# Altium project GiroScopeTest.PrjPcb (part 2 of 2)

## Sheet Dual_chanel.SchDoc
size A1; SheetNumber: 2; SheetTotal: 2
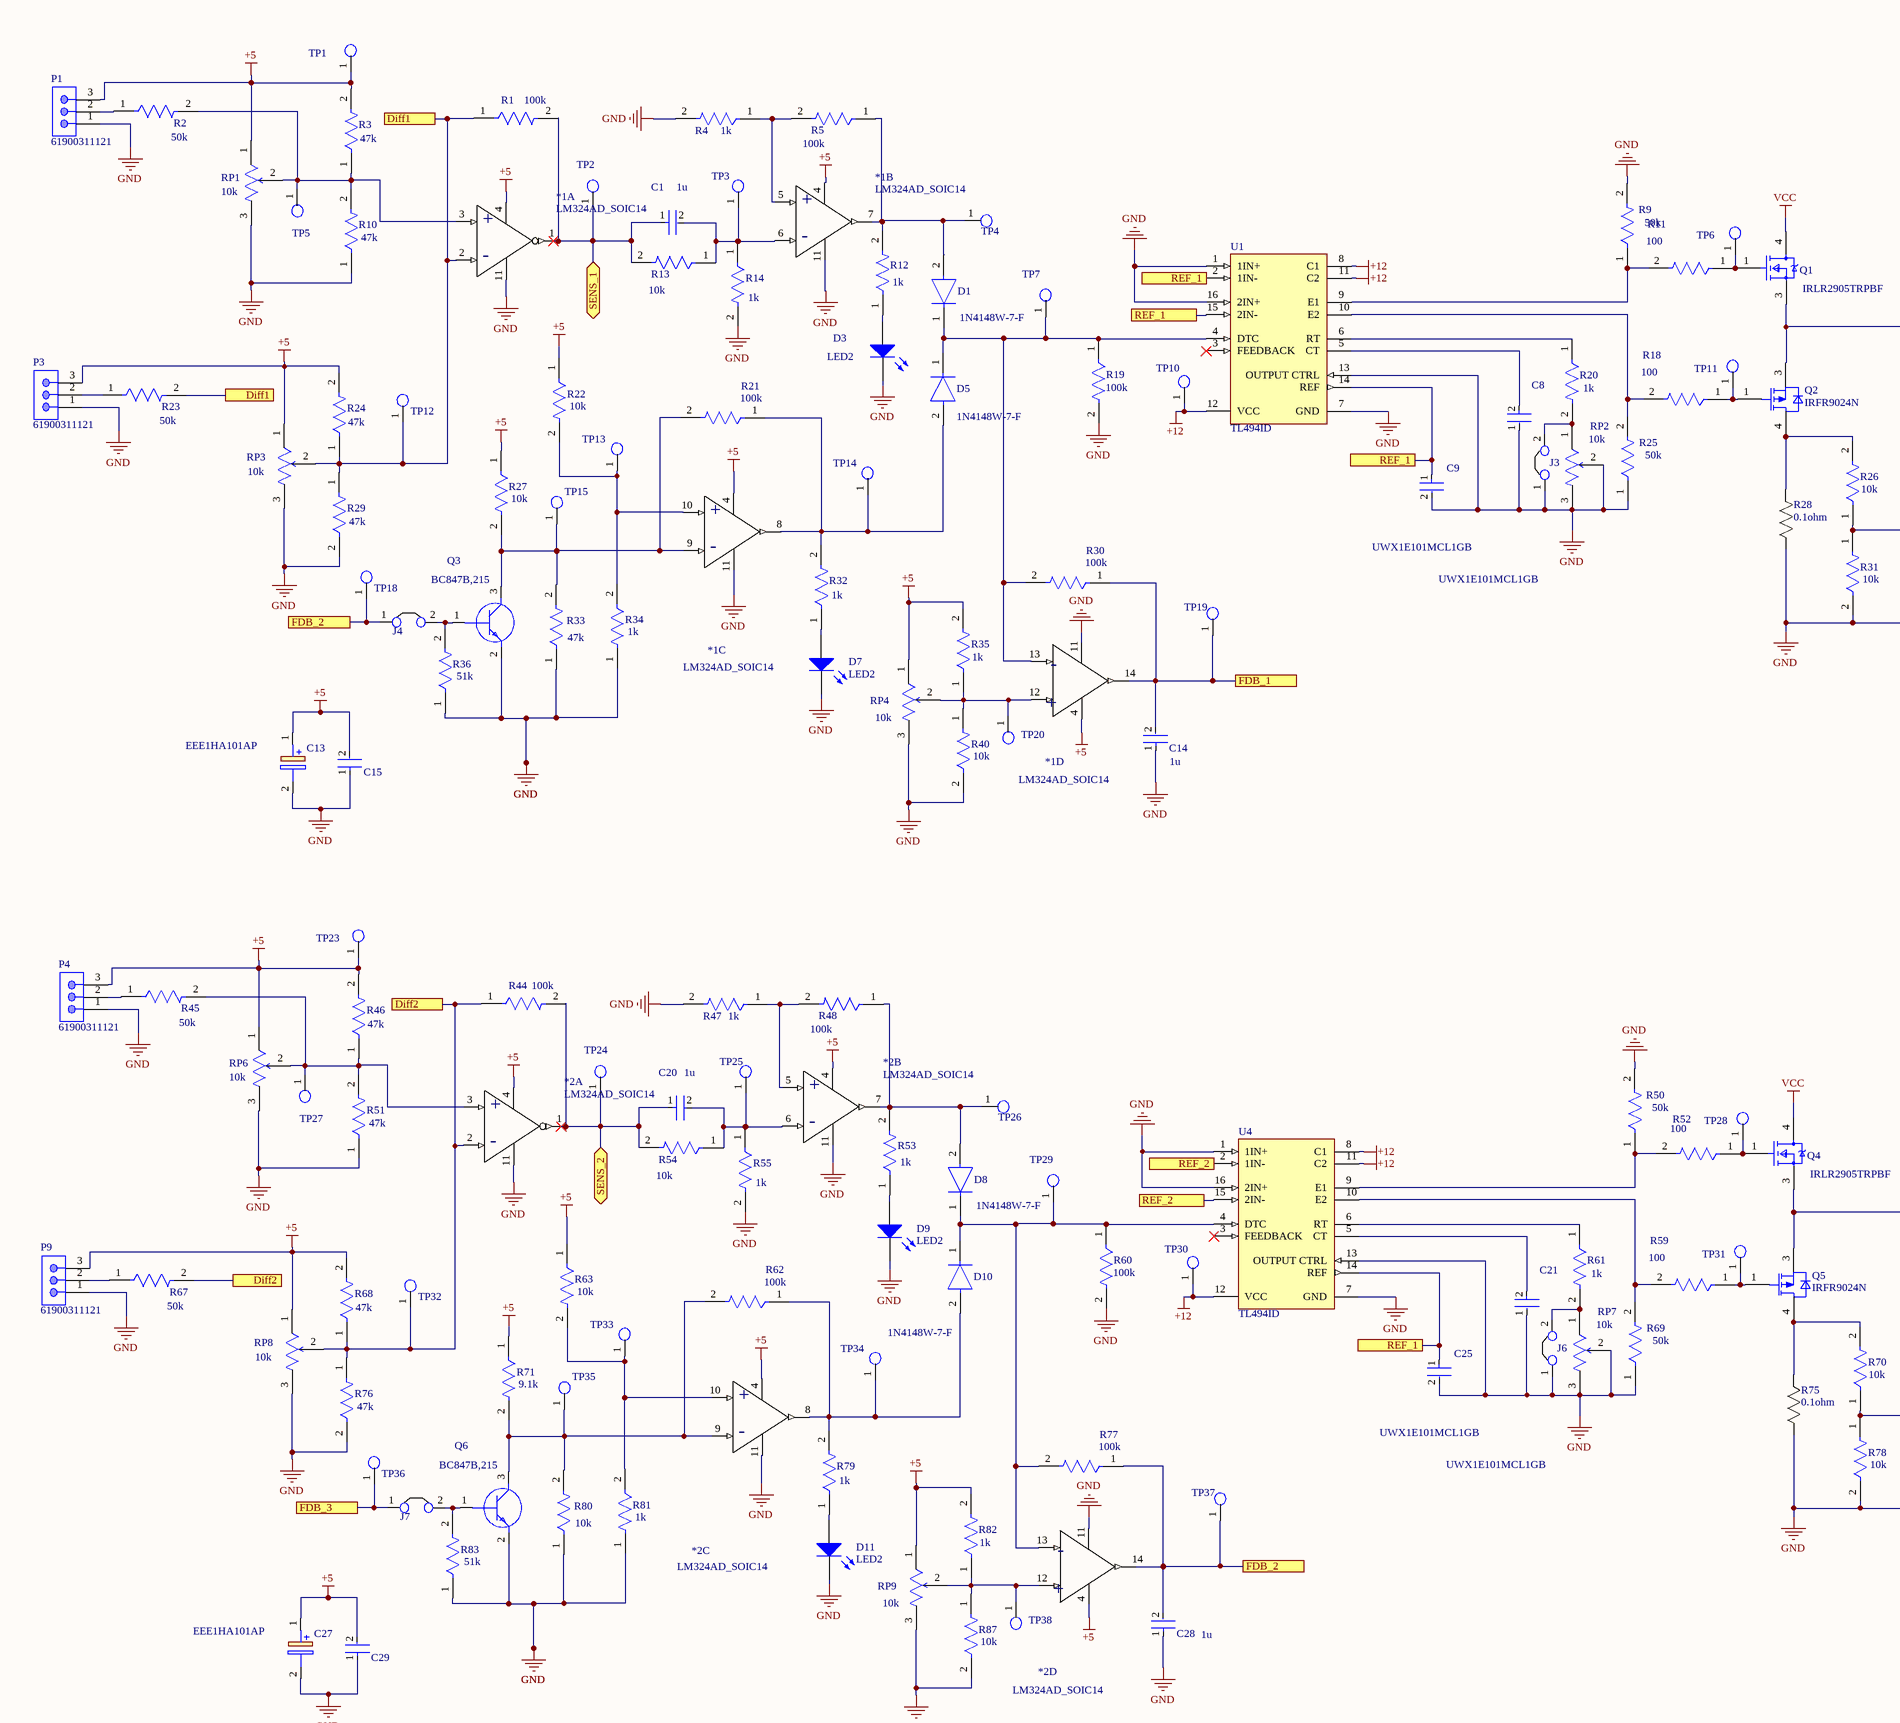
[diagram p4: Dual_chanel.SchDoc, top left]
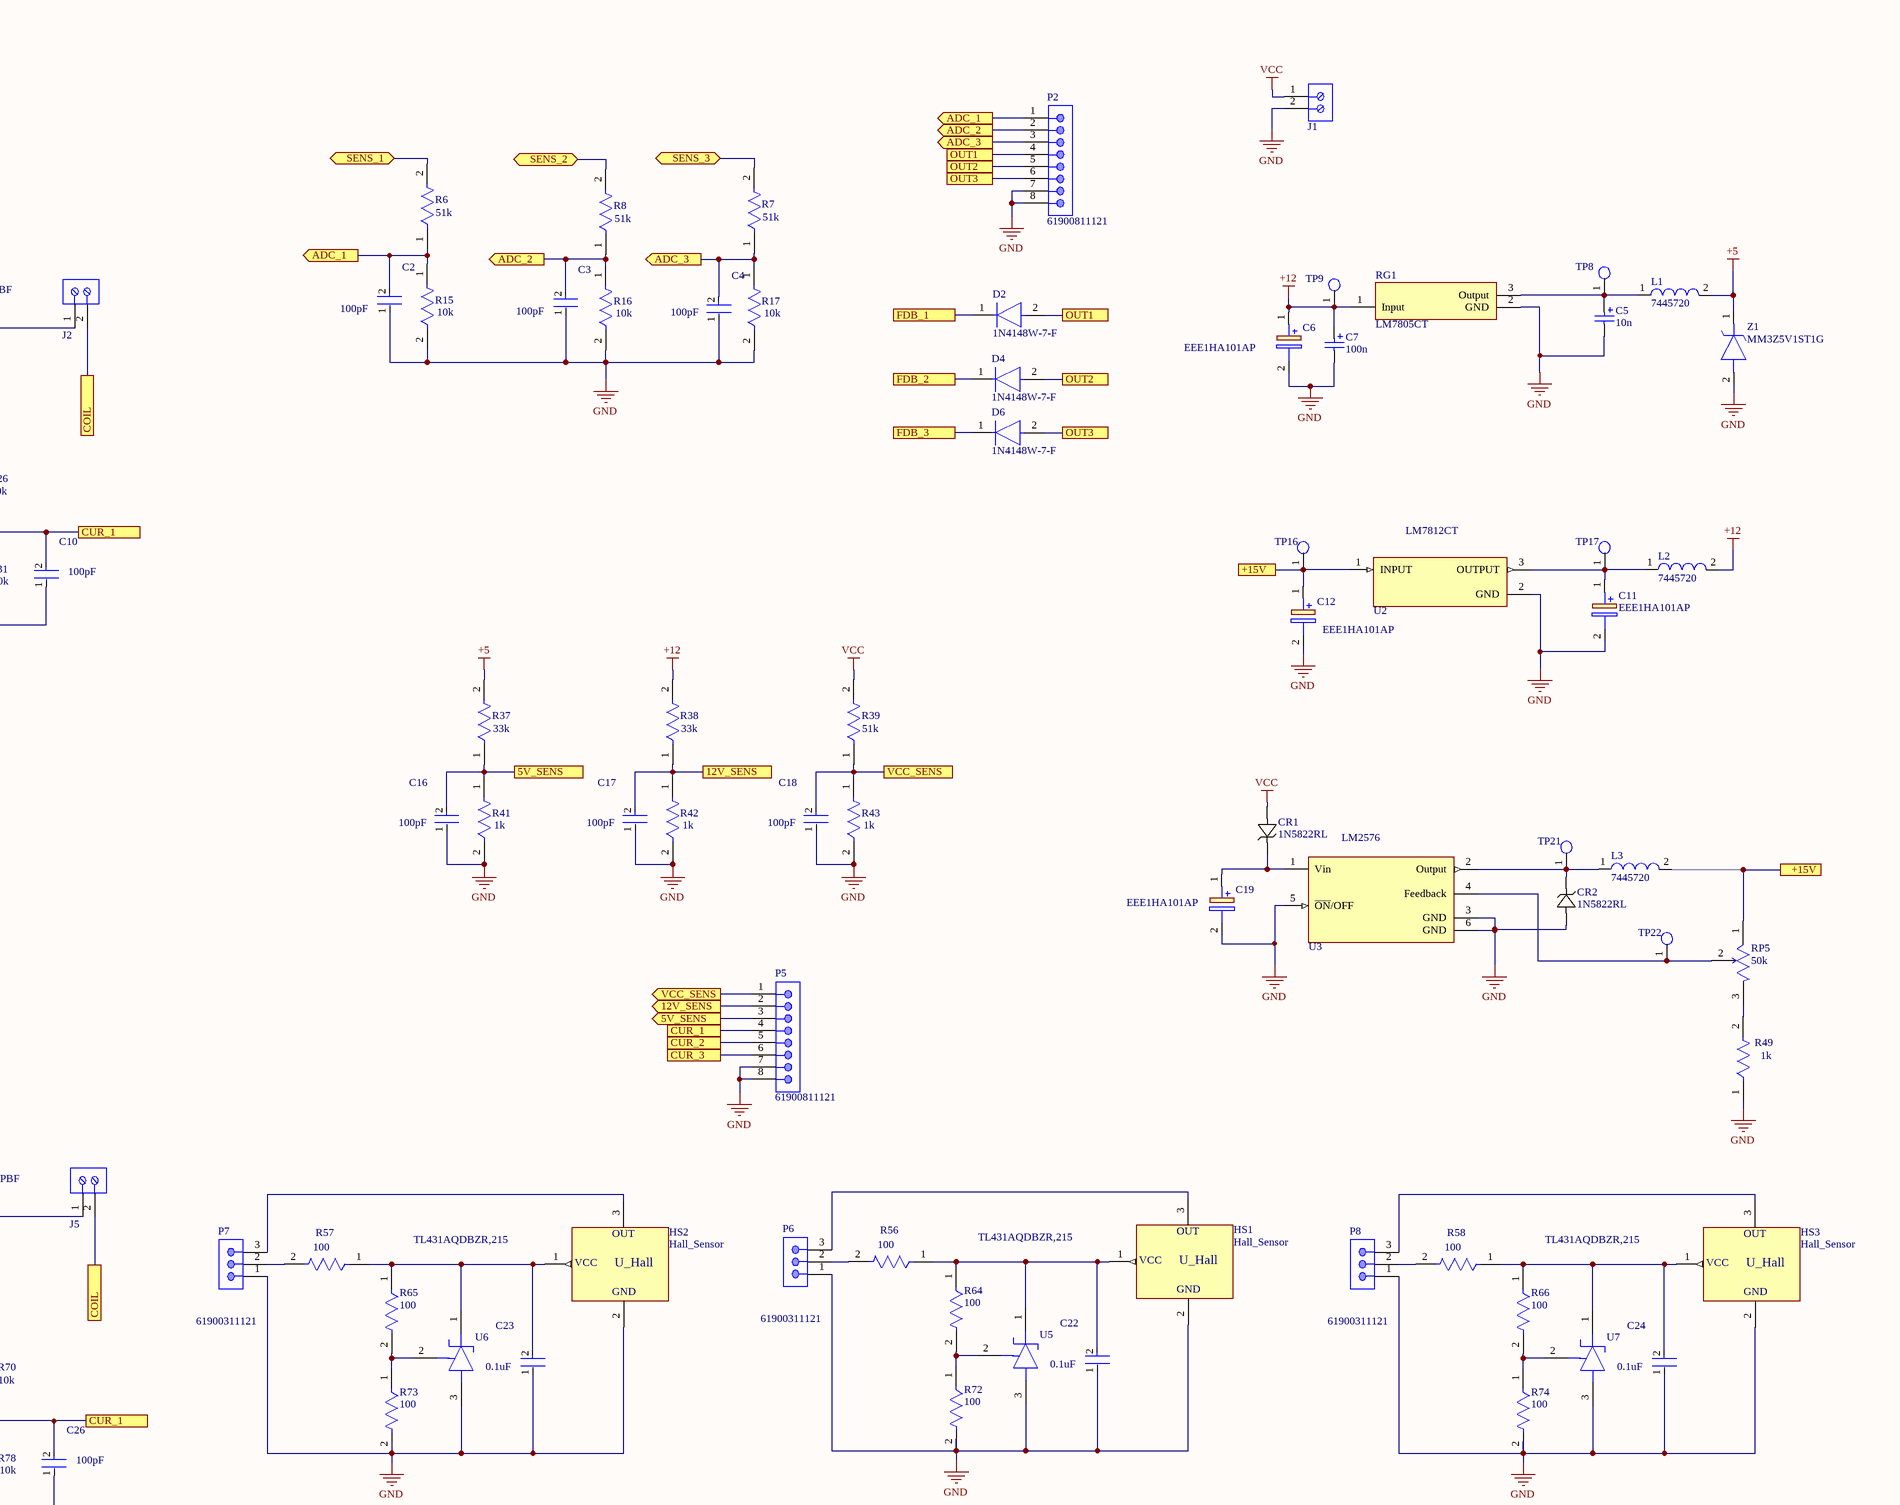
[diagram p5: Dual_chanel.SchDoc, top right]
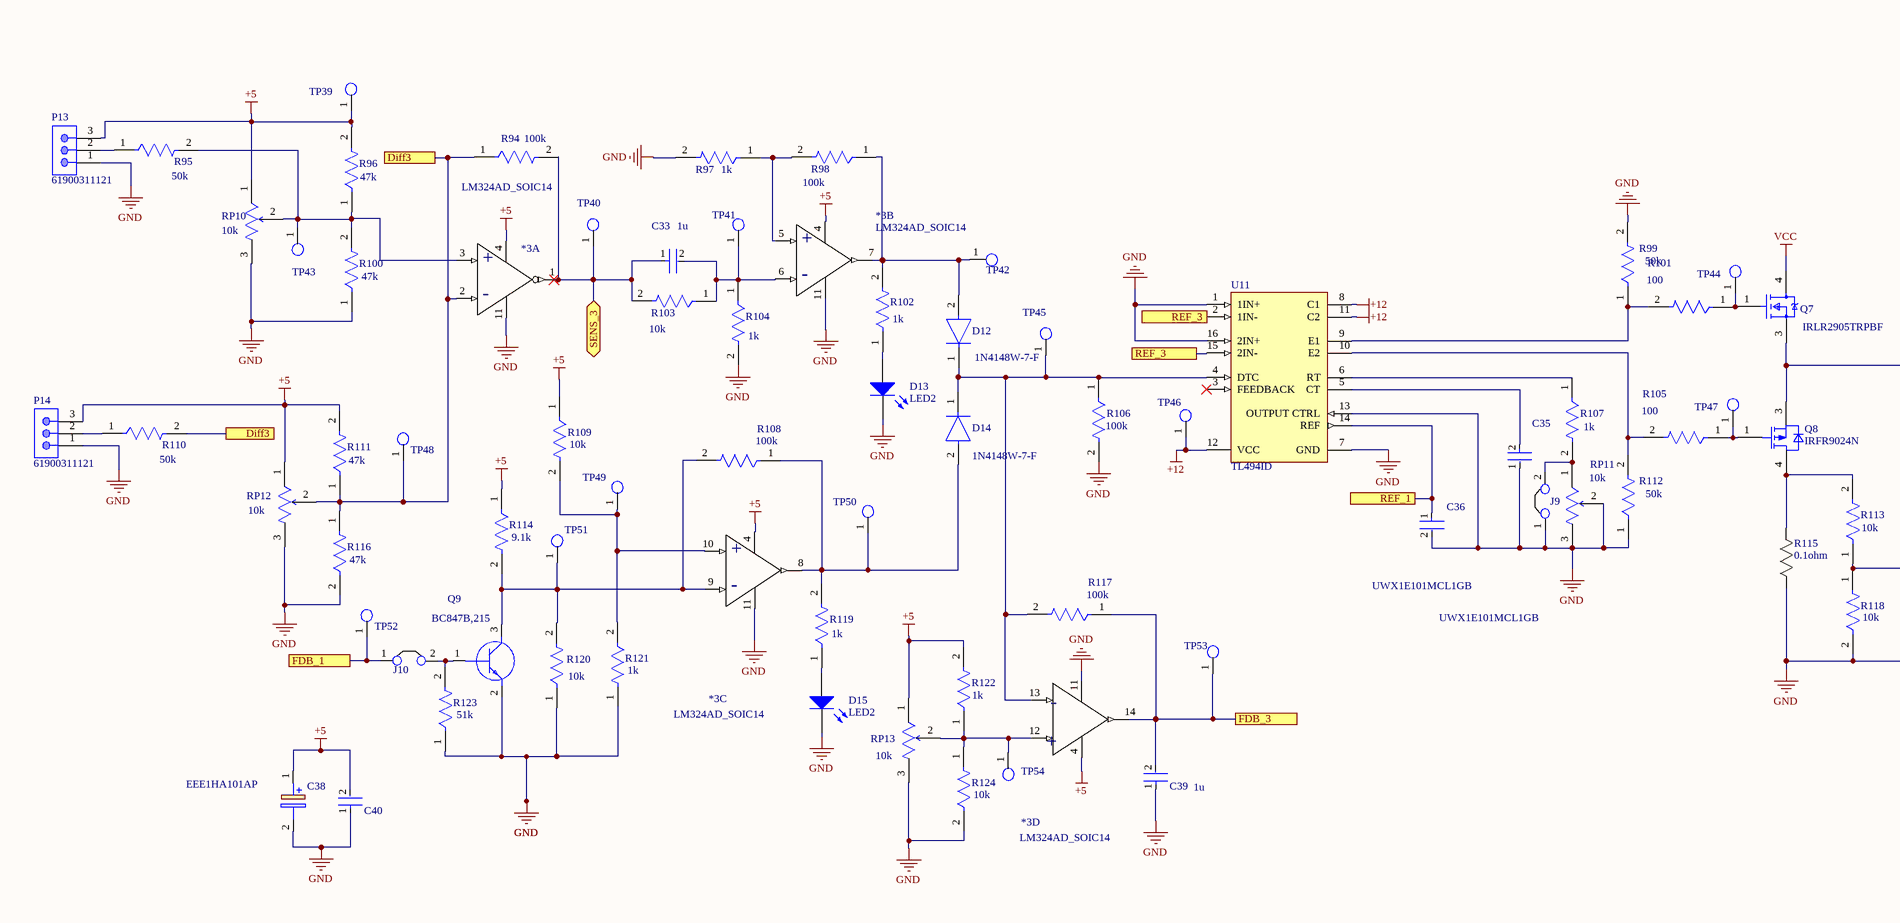
[diagram p6: Dual_chanel.SchDoc, bottom left]
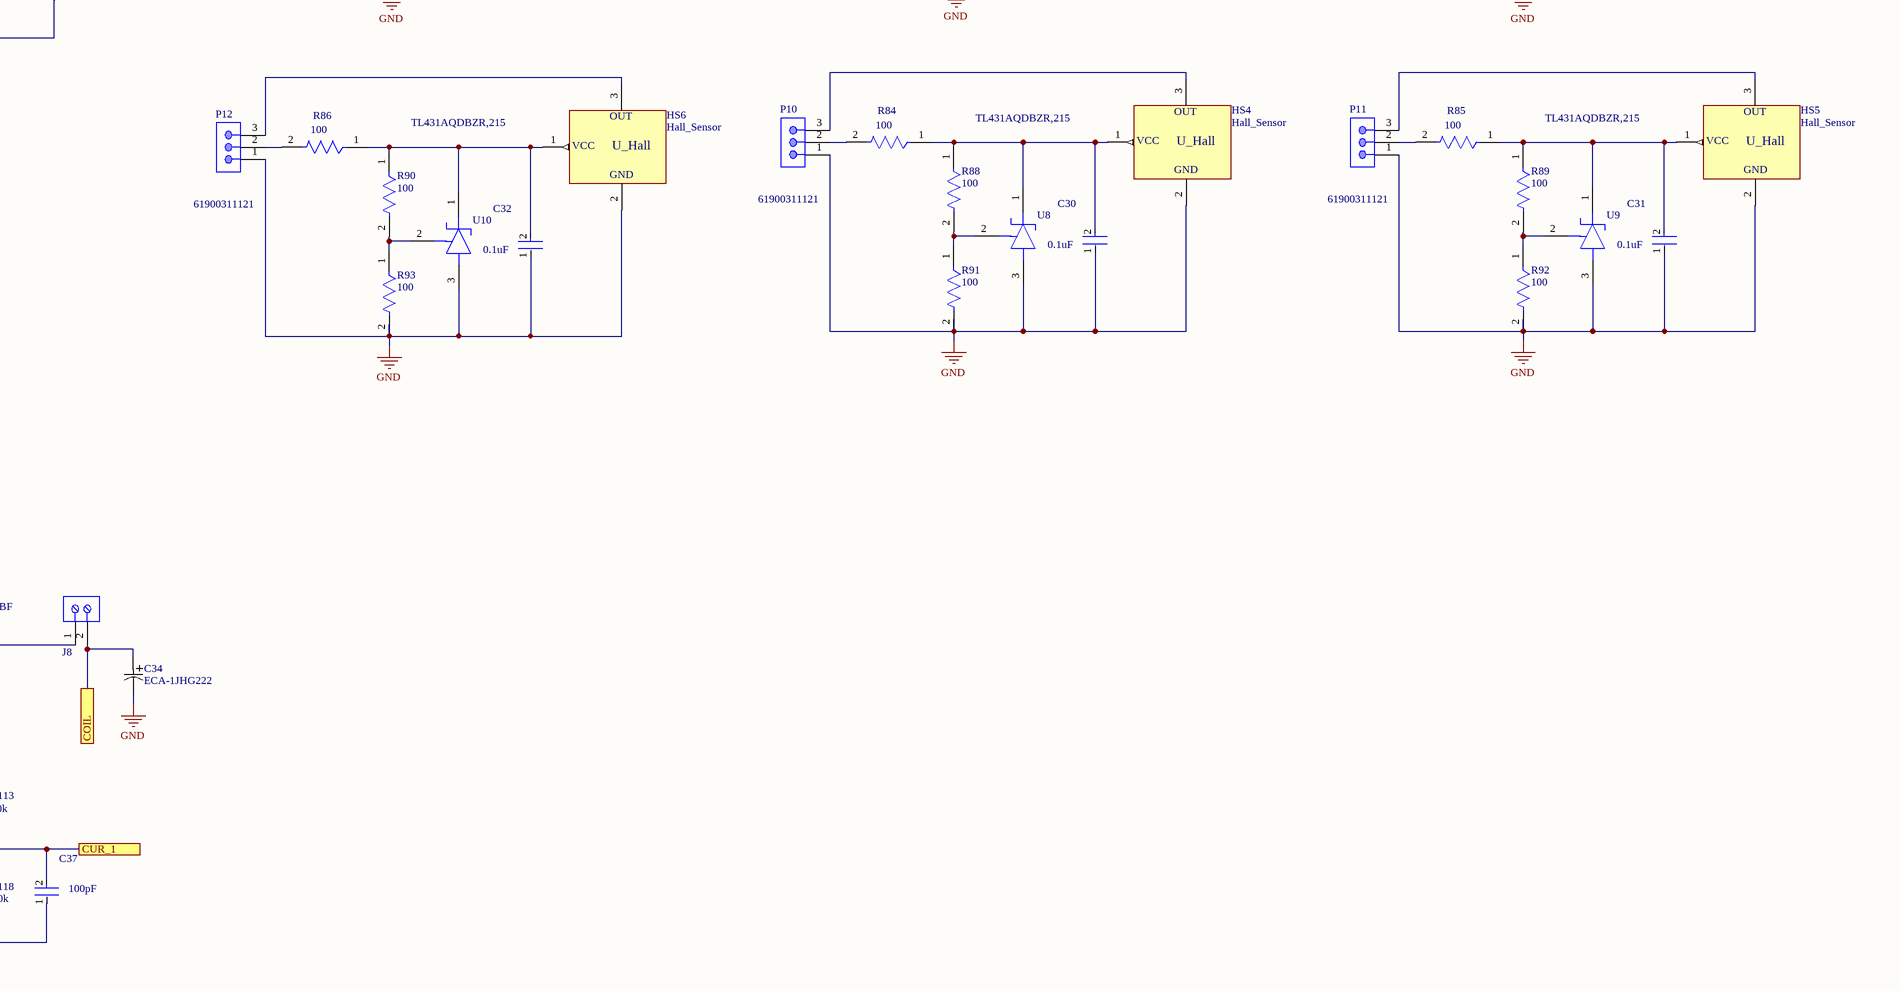
[diagram p7: Dual_chanel.SchDoc, bottom right]

### Parts
(Parts that share a designator on the sheet are numbered #1, #2 ... from top to bottom, then left to right.)
*1#2  LM324AD_SOIC14  [D14-M]  (parts A,B,C,D of 4)
*2#2  LM324AD_SOIC14  [D14-M]  (parts A,B,C,D of 4)
*3  LM324AD_SOIC14  [D14-M]  (parts A,B,C,D of 4)
C1#2  1u  [KEMET_C0805C-DN_IPC_A]
C2#2  100pF  [KEMET_C0805C-DN_IPC_A]
C3#2  100pF  [KEMET_C0805C-DN_IPC_A]
C4#2  100pF  [KEMET_C0805C-DN_IPC_A]
C5#2  10n  [KEMET_C0805C-DN_IPC_A]
C6#2  EEE1HA101AP  [EEEFK1V331P]
C7#2  100n  [KEMET_C0805C-DN_IPC_A]
C8#2  UWX1E101MCL1GB  [KEMET_C0805C-DN_IPC_A]
C9#2  UWX1E101MCL1GB  [KEMET_C0805C-DN_IPC_A]
C10#2  100pF  [KEMET_C0805C-DN_IPC_A]
C11#2  EEE1HA101AP  [EEEFK1V331P]
C12#2  EEE1HA101AP  [EEEFK1V331P]
C13#2  EEE1HA101AP  [EEEFK1V331P]
C14#2  1u  [KEMET_C0805C-DN_IPC_A]
C15#2  1u  [KEMET_C0805C-DN_IPC_A]  (value not drawn)
C16#2  100pF  [KEMET_C0805C-DN_IPC_A]
C17#2  100pF  [KEMET_C0805C-DN_IPC_A]
C18#2  100pF  [KEMET_C0805C-DN_IPC_A]
C19#2  EEE1HA101AP  [EEEFK1V331P]
C20#2  1u  [KEMET_C0805C-DN_IPC_A]
C21#2  UWX1E101MCL1GB  [KEMET_C0805C-DN_IPC_A]
C22#2  0.1uF  [KEMET_C0805C-DN_IPC_C]
C23#2  0.1uF  [KEMET_C0805C-DN_MFG]
C24#2  0.1uF  [KEMET_C0805C-DN_IPC_C]
C25#2  UWX1E101MCL1GB  [KEMET_C0805C-DN_IPC_A]
C26#2  100pF  [KEMET_C0805C-DN_IPC_A]
C27#2  EEE1HA101AP  [EEEFK1V331P]
C28#2  1u  [KEMET_C0805C-DN_IPC_A]
C29#2  1u  [KEMET_C0805C-DN_IPC_A]  (value not drawn)
C30#2  0.1uF  [KEMET_C0805C-DN_IPC_C]
C31#2  0.1uF  [KEMET_C0805C-DN_IPC_C]
C32#2  0.1uF  [KEMET_C0805C-DN_MFG]
C33#2  1u  [KEMET_C0805C-DN_IPC_A]
C34#2  ECA-1JHG222  [CAPPRD500W60D1000H1250]
C35#2  UWX1E101MCL1GB  [KEMET_C0805C-DN_IPC_A]
C36#2  UWX1E101MCL1GB  [KEMET_C0805C-DN_IPC_A]
C37#2  100pF  [KEMET_C0805C-DN_IPC_A]
C38#2  EEE1HA101AP  [EEEFK1V331P]
C39#2  1u  [KEMET_C0805C-DN_IPC_A]
C40  1u  [KEMET_C0805C-DN_IPC_A]  (value not drawn)
CR1#2  1N5822RL  [DO-201AD_STM]
CR2#2  1N5822RL  [DO-201AD_STM]
D1#2  1N4148W-7-F  [ONSC-SOD-123-2-425-04_V]
D2#2  1N4148W-7-F  [Vishay_S8-V-3910_01-001_IPC_A]
D3#2  LED2  [Wurth_Electronics_0_MFG]
D4#2  1N4148W-7-F  [Vishay_S8-V-3910_01-001_IPC_A]
D5#2  1N4148W-7-F  [ONSC-SOD-123-2-425-04_V]
D6#2  1N4148W-7-F  [Vishay_S8-V-3910_01-001_IPC_A]
D7#2  LED2  [Wurth_Electronics_0_MFG]
D8#2  1N4148W-7-F  [Vishay_S8-V-3910_01-001_IPC_A]
D9#2  LED2  [Wurth_Electronics_0_MFG]
D10#2  1N4148W-7-F  [Vishay_S8-V-3910_01-001_IPC_A]
D11#2  LED2  [Wurth_Electronics_0_MFG]
D12#2  1N4148W-7-F  [Vishay_S8-V-3910_01-001_IPC_A]
D13#2  LED2  [Wurth_Electronics_0_MFG]
D14#2  1N4148W-7-F  [Vishay_S8-V-3910_01-001_IPC_A]
D15#2  LED2  [Wurth_Electronics_0_MFG]
HS1#2  Hall_Sensor  [TO-92A]
HS2#2  Hall_Sensor  [TO-92A]
HS3#2  Hall_Sensor  [TO-92A]
HS4#2  Hall_Sensor  [TO-92A]
HS5#2  Hall_Sensor  [TO-92A]
HS6#2  Hall_Sensor  [TO-92A]
J1#2  691103110003  [691101710002]  (value not drawn)
J2#2  691101710002  [691101710002]  (value not drawn)
J3#2  Jumper 1x2.54  [Jumper_2.54]  (value not drawn)
J4#2  Jumper 1x2.54  [Jumper_2.54]  (value not drawn)
J5#2  691101710002  [691101710002]  (value not drawn)
J6#2  Jumper 1x2.54  [Jumper_2.54]  (value not drawn)
J7#2  Jumper 1x2.54  [Jumper_2.54]  (value not drawn)
J8#2  691101710002  [691101710002]  (value not drawn)
J9#2  Jumper 1x2.54  [Jumper_2.54]  (value not drawn)
J10#2  Jumper 1x2.54  [Jumper_2.54]  (value not drawn)
L1#2  7445720  [WE-PD2-L]
L2#2  7445720  [WE-PD2-L]
L3#2  7445720  [WE-PD2-L]
P1#2  61900311121  [61900311121]
P2#2  61900811121  [61900811121]
P3#2  61900311121  [61900311121]
P4#2  61900311121  [61900311121]
P5#2  61900811121  [61900811121]
P6#2  61900311121  [61900311121]
P7#2  61900311121  [61900311121]
P8#2  61900311121  [61900311121]
P9#2  61900311121  [61900311121]
P10#2  61900311121  [61900311121]
P11#2  61900311121  [61900311121]
P12#2  61900311121  [61900311121]
P13#2  61900311121  [61900311121]
P14#2  61900311121  [61900311121]
Q1#2  IRLR2905TRPBF  [TO229P991X239-3_4N]
Q2#2  IRFR9024N  [TO229P991X239-3_4N]
Q3#2  BC847B,215  [BC847B215]
Q4#2  IRLR2905TRPBF  [Infineon_Technologies_PG-TO252-3_MFG]
Q5#2  IRFR9024N  [TO229P991X239-3_4N]
Q6#2  BC847B,215  [BC847B215]
Q7  IRLR2905TRPBF  [Infineon_Technologies_PG-TO252-3_MFG]
Q8  IRFR9024N  [TO229P991X239-3_4N]
Q9  BC847B,215  [BC847B215]
R1#2  100k  [Vishay_CRCW0805-e3_IPC_A]
R2#2  50k  [Vishay_CRCW0805-e3_IPC_A]
R3#2  47k  [Vishay_CRCW0805-e3_IPC_A]
R4#2  1k  [Vishay_CRCW0805-e3_IPC_A]
R5#2  100k  [Vishay_CRCW0805-e3_IPC_A]
R6#2  51k  [Vishay_CRCW0805-e3_IPC_A]
R7#2  51k  [Vishay_CRCW0805-e3_IPC_A]
R8#2  51k  [Vishay_CRCW0805-e3_IPC_A]
R9#2  50k  [Vishay_CRCW0805-e3_IPC_A]
R10#2  47k  [Vishay_CRCW0805-e3_IPC_A]
R11#2  100  [Vishay_CRCW0805-e3_IPC_A]
R12#2  1k  [Vishay_CRCW0805-e3_IPC_A]
R13#2  10k  [Vishay_CRCW0805-e3_IPC_A]
R14#2  1k  [Vishay_CRCW0805-e3_IPC_A]
R15#2  10k  [Vishay_CRCW0805-e3_IPC_A]
R16#2  10k  [Vishay_CRCW0805-e3_IPC_A]
R17#2  10k  [Vishay_CRCW0805-e3_IPC_A]
R18#2  100  [Vishay_CRCW0805-e3_IPC_A]
R19#2  100k  [Vishay_CRCW0805-e3_IPC_A]
R20#2  1k  [Vishay_CRCW0805-e3_IPC_A]
R21#2  100k  [Vishay_CRCW0805-e3_IPC_A]
R22#2  10k  [Vishay_CRCW0805-e3_IPC_A]
R23#2  50k  [Vishay_CRCW0805-e3_IPC_A]
R24#2  47k  [Vishay_CRCW0805-e3_IPC_A]
R25#2  50k  [Vishay_CRCW0805-e3_IPC_A]
R26#2  10k  [Vishay_CRCW0805-e3_IPC_A]
R27#2  10k  [Vishay_CRCW0805-e3_IPC_A]
R28#2  0.1ohm  [RES_TUM5_OHM]
R29#2  47k  [Vishay_CRCW0805-e3_IPC_A]
R30#2  100k  [Vishay_CRCW0805-e3_IPC_A]
R31#2  10k  [Vishay_CRCW0805-e3_IPC_A]
R32  1k  [Vishay_CRCW0805-e3_IPC_A]
R33#2  47k  [Vishay_CRCW0805-e3_IPC_A]
R34#2  1k  [Vishay_CRCW0805-e3_IPC_A]
R35#2  1k  [Vishay_CRCW0805-e3_IPC_A]
R36#2  51k  [Vishay_CRCW0805-e3_IPC_A]
R37#2  33k  [Vishay_CRCW0805-e3_IPC_A]
R38#2  33k  [Vishay_CRCW0805-e3_IPC_A]
R39#2  51k  [Vishay_CRCW0805-e3_IPC_A]
R40  10k  [Vishay_CRCW0805-e3_IPC_A]
R41#2  1k  [Vishay_CRCW0805-e3_IPC_A]
R42#2  1k  [Vishay_CRCW0805-e3_IPC_A]
R43#2  1k  [Vishay_CRCW0805-e3_IPC_A]
R44  100k  [Vishay_CRCW0805-e3_IPC_A]
R45#2  50k  [Vishay_CRCW0805-e3_IPC_A]
R46#2  47k  [Vishay_CRCW0805-e3_IPC_A]
R47#2  1k  [Vishay_CRCW0805-e3_IPC_A]
R48#2  100k  [Vishay_CRCW0805-e3_IPC_A]
R49#2  1k  [Vishay_CRCW0805-e3_IPC_A]
R50#2  50k  [Vishay_CRCW0805-e3_IPC_A]
R51#2  47k  [Vishay_CRCW0805-e3_IPC_A]
R52#2  100  [Vishay_CRCW0805-e3_IPC_A]
R53#2  1k  [Vishay_CRCW0805-e3_IPC_A]
R54#2  10k  [Vishay_CRCW0805-e3_IPC_A]
R55#2  1k  [Vishay_CRCW0805-e3_IPC_A]
R56#2  100  [Vishay_CRCW0805-e3_IPC_B]
R57#2  100  [Vishay_CRCW0805-e3_IPC_B]
R58#2  100  [Vishay_CRCW0805-e3_IPC_B]
R59  100  [Vishay_CRCW0805-e3_IPC_A]
R60#2  100k  [Vishay_CRCW0805-e3_IPC_A]
R61#2  1k  [Vishay_CRCW0805-e3_IPC_A]
R62#2  100k  [Vishay_CRCW0805-e3_IPC_A]
R63#2  10k  [Vishay_CRCW0805-e3_IPC_A]
R64#2  100  [Vishay_CRCW0805-e3_IPC_B]
R65#2  100  [Vishay_CRCW0805-e3_IPC_B]
R66  100  [Vishay_CRCW0805-e3_IPC_B]
R67#2  50k  [Vishay_CRCW0805-e3_IPC_A]
R68#2  47k  [Vishay_CRCW0805-e3_IPC_A]
R69#2  50k  [Vishay_CRCW0805-e3_IPC_A]
R70  10k  [Vishay_CRCW0805-e3_IPC_A]
R71#2  9.1k  [Vishay_CRCW0805-e3_IPC_A]
R72#2  100  [Vishay_CRCW0805-e3_IPC_B]
R73#2  100  [Vishay_CRCW0805-e3_IPC_B]
R74#2  100  [Vishay_CRCW0805-e3_IPC_B]
R75#2  0.1ohm  [RES_TUM5_OHM]
R76#2  47k  [Vishay_CRCW0805-e3_IPC_A]
R77#2  100k  [Vishay_CRCW0805-e3_IPC_A]
R78#2  10k  [Vishay_CRCW0805-e3_IPC_A]
R79#2  1k  [Vishay_CRCW0805-e3_IPC_A]
R80#2  10k  [Vishay_CRCW0805-e3_IPC_A]
R81#2  1k  [Vishay_CRCW0805-e3_IPC_A]
R82#2  1k  [Vishay_CRCW0805-e3_IPC_A]
R83#2  51k  [Vishay_CRCW0805-e3_IPC_A]
R84#2  100  [Vishay_CRCW0805-e3_IPC_B]
R85#2  100  [Vishay_CRCW0805-e3_IPC_B]
R86#2  100  [Vishay_CRCW0805-e3_IPC_B]
R87#2  10k  [Vishay_CRCW0805-e3_IPC_A]
R88#2  100  [Vishay_CRCW0805-e3_IPC_B]
R89#2  100  [Vishay_CRCW0805-e3_IPC_B]
R90#2  100  [Vishay_CRCW0805-e3_IPC_B]
R91#2  100  [Vishay_CRCW0805-e3_IPC_B]
R92#2  100  [Vishay_CRCW0805-e3_IPC_B]
R93#2  100  [Vishay_CRCW0805-e3_IPC_B]
R94#2  100k  [Vishay_CRCW0805-e3_IPC_A]
R95#2  50k  [Vishay_CRCW0805-e3_IPC_A]
R96#2  47k  [Vishay_CRCW0805-e3_IPC_A]
R97#2  1k  [Vishay_CRCW0805-e3_IPC_A]
R98#2  100k  [Vishay_CRCW0805-e3_IPC_A]
R99#2  50k  [Vishay_CRCW0805-e3_IPC_A]
R100#2  47k  [Vishay_CRCW0805-e3_IPC_A]
R101#2  100  [Vishay_CRCW0805-e3_IPC_A]
R102#2  1k  [Vishay_CRCW0805-e3_IPC_A]
R103#2  10k  [Vishay_CRCW0805-e3_IPC_A]
R104#2  1k  [Vishay_CRCW0805-e3_IPC_A]
R105#2  100  [Vishay_CRCW0805-e3_IPC_A]
R106#2  100k  [Vishay_CRCW0805-e3_IPC_A]
R107#2  1k  [Vishay_CRCW0805-e3_IPC_A]
R108#2  100k  [Vishay_CRCW0805-e3_IPC_A]
R109#2  10k  [Vishay_CRCW0805-e3_IPC_A]
R110#2  50k  [Vishay_CRCW0805-e3_IPC_A]
R111#2  47k  [Vishay_CRCW0805-e3_IPC_A]
R112#2  50k  [Vishay_CRCW0805-e3_IPC_A]
R113#2  10k  [Vishay_CRCW0805-e3_IPC_A]
R114#2  9.1k  [Vishay_CRCW0805-e3_IPC_A]
R115#2  0.1ohm  [RES_TUM5_OHM]
R116#2  47k  [Vishay_CRCW0805-e3_IPC_A]
R117#2  100k  [Vishay_CRCW0805-e3_IPC_A]
R118#2  10k  [Vishay_CRCW0805-e3_IPC_A]
R119#2  1k  [Vishay_CRCW0805-e3_IPC_A]
R120#2  10k  [Vishay_CRCW0805-e3_IPC_A]
R121#2  1k  [Vishay_CRCW0805-e3_IPC_A]
R122#2  1k  [Vishay_CRCW0805-e3_IPC_A]
R123#2  51k  [Vishay_CRCW0805-e3_IPC_A]
R124#2  10k  [Vishay_CRCW0805-e3_IPC_A]
RG1#2  Part Number: LM7805CT  [Fairchild_LM7805CT_0]  (hidden comment: Reg_Fairchild_LM7805CT_eec)
RP1#2  10k  [Bourns_3296W_MFG]
RP2#2  10k  [Bourns_3296W_MFG]
RP3#2  10k  [Bourns_3296W_MFG]
RP4#2  10k  [Bourns_3296W_MFG]
RP5#2  50k  [Bourns_3296W_MFG]
RP6#2  10k  [Bourns_3296W_MFG]
RP7#2  10k  [Bourns_3296W_MFG]
RP8#2  10k  [Bourns_3296W_MFG]
RP9#2  10k  [Bourns_3296W_MFG]
RP10#2  10k  [Bourns_3296W_MFG]
RP11#2  10k  [Bourns_3296W_MFG]
RP12#2  10k  [Bourns_3296W_MFG]
RP13#2  10k  [Bourns_3296W_MFG]
TP1#2  Test_Point_PCB  [Test_Point]  (value not drawn)
TP2#2  Test_Point_PCB  [Test_Point]  (value not drawn)
TP3#2  Test_Point_PCB  [Test_Point]  (value not drawn)
TP4#2  Test_Point_PCB  [Test_Point]  (value not drawn)
TP5#2  Test_Point_PCB  [Test_Point]  (value not drawn)
TP6#2  Test_Point_PCB  [Test_Point]  (value not drawn)
TP7#2  Test_Point_PCB  [Test_Point]  (value not drawn)
TP8#2  Test_Point_PCB  [Test_Point]  (value not drawn)
TP9#2  Test_Point_PCB  [Test_Point]  (value not drawn)
TP10#2  Test_Point_PCB  [Test_Point]  (value not drawn)
TP11#2  Test_Point_PCB  [Test_Point]  (value not drawn)
TP12#2  Test_Point_PCB  [Test_Point]  (value not drawn)
TP13#2  Test_Point_PCB  [Test_Point]  (value not drawn)
TP14#2  Test_Point_PCB  [Test_Point]  (value not drawn)
TP15#2  Test_Point_PCB  [Test_Point]  (value not drawn)
TP16#2  Test_Point_PCB  [Test_Point]  (value not drawn)
TP17#2  Test_Point_PCB  [Test_Point]  (value not drawn)
TP18#2  Test_Point_PCB  [Test_Point]  (value not drawn)
TP19#2  Test_Point_PCB  [Test_Point]  (value not drawn)
TP20#2  Test_Point_PCB  [Test_Point]  (value not drawn)
TP21#2  Test_Point_PCB  [Test_Point]  (value not drawn)
TP22#2  Test_Point_PCB  [Test_Point]  (value not drawn)
TP23#2  Test_Point_PCB  [Test_Point]  (value not drawn)
TP24#2  Test_Point_PCB  [Test_Point]  (value not drawn)
TP25#2  Test_Point_PCB  [Test_Point]  (value not drawn)
TP26#2  Test_Point_PCB  [Test_Point]  (value not drawn)
TP27#2  Test_Point_PCB  [Test_Point]  (value not drawn)
TP28#2  Test_Point_PCB  [Test_Point]  (value not drawn)
TP29#2  Test_Point_PCB  [Test_Point]  (value not drawn)
TP30#2  Test_Point_PCB  [Test_Point]  (value not drawn)
TP31#2  Test_Point_PCB  [Test_Point]  (value not drawn)
TP32#2  Test_Point_PCB  [Test_Point]  (value not drawn)
TP33#2  Test_Point_PCB  [Test_Point]  (value not drawn)
TP34#2  Test_Point_PCB  [Test_Point]  (value not drawn)
TP35#2  Test_Point_PCB  [Test_Point]  (value not drawn)
TP36#2  Test_Point_PCB  [Test_Point]  (value not drawn)
TP37#2  Test_Point_PCB  [Test_Point]  (value not drawn)
TP38#2  Test_Point_PCB  [Test_Point]  (value not drawn)
TP39#2  Test_Point_PCB  [Test_Point]  (value not drawn)
TP40#2  Test_Point_PCB  [Test_Point]  (value not drawn)
TP41#2  Test_Point_PCB  [Test_Point]  (value not drawn)
TP42#2  Test_Point_PCB  [Test_Point]  (value not drawn)
TP43#2  Test_Point_PCB  [Test_Point]  (value not drawn)
TP44#2  Test_Point_PCB  [Test_Point]  (value not drawn)
TP45#2  Test_Point_PCB  [Test_Point]  (value not drawn)
TP46#2  Test_Point_PCB  [Test_Point]  (value not drawn)
TP47#2  Test_Point_PCB  [Test_Point]  (value not drawn)
TP48#2  Test_Point_PCB  [Test_Point]  (value not drawn)
TP49#2  Test_Point_PCB  [Test_Point]  (value not drawn)
TP50#2  Test_Point_PCB  [Test_Point]  (value not drawn)
TP51#2  Test_Point_PCB  [Test_Point]  (value not drawn)
TP52  Test_Point_PCB  [Test_Point]  (value not drawn)
TP53  Test_Point_PCB  [Test_Point]  (value not drawn)
TP54  Test_Point_PCB  [Test_Point]  (value not drawn)
U1#2  TL494ID  [D16-M]
U2#2  LM7812CT  [Fairchild_LM7805CT_0]
U3#2  LM2576  [ON_Semiconductor_936A-02_MFG]
U4#2  TL494ID  [D16-M]
U5#2  Part Number: TL431AQDBZR,215  [Nexperia_TL431AQDBZR,215_0]  (hidden comment: IC_Nexperia_TL431AQDBZR,215_eec)
U6#2  Part Number: TL431AQDBZR,215  [Nexperia_TL431AQDBZR,215_0]  (hidden comment: IC_Nexperia_TL431AQDBZR,215_eec)
U7#2  Part Number: TL431AQDBZR,215  [Nexperia_TL431AQDBZR,215_0]  (hidden comment: IC_Nexperia_TL431AQDBZR,215_eec)
U8#2  Part Number: TL431AQDBZR,215  [Nexperia_TL431AQDBZR,215_0]  (hidden comment: IC_Nexperia_TL431AQDBZR,215_eec)
U9#2  Part Number: TL431AQDBZR,215  [Nexperia_TL431AQDBZR,215_0]  (hidden comment: IC_Nexperia_TL431AQDBZR,215_eec)
U10#2  Part Number: TL431AQDBZR,215  [Nexperia_TL431AQDBZR,215_0]  (hidden comment: IC_Nexperia_TL431AQDBZR,215_eec)
U11#2  TL494ID  [D16-M]
Z1#2  MM3Z5V1ST1G  [SOD2512X110N]

### Ports
5V_SENS, 5V_SENS (out), 12V_SENS, 12V_SENS (out), +15V, ADC_1 (out), ADC_2 (out), ADC_3 (out), COIL, CUR_1, CUR_2, CUR_3, Diff1, Diff2, Diff3, FDB_1, FDB_2, FDB_3, OUT1, OUT2, OUT3, REF_1, REF_2, REF_3, SENS_1 (bidir), SENS_2 (bidir), SENS_3 (bidir), VCC_SENS, VCC_SENS (out)

### Nets
+5: *1#2.4(+VCC) *2#2.4(+VCC) *3.4(+VCC) C13#2.1(+) C15#2.2 C27#2.1(+) C29#2.2 C38#2.1(+) C40.2 L1#2.2 P1#2.3 P3#2.3 P4#2.3 P9#2.3 P13#2.3 P14#2.3 R3#2.2 R22#2.1 R24#2.2 R27#2.1 R35#2.2 R37#2.2 R46#2.2 R63#2.1 R68#2.2 R71#2.1 R82#2.2 R96#2.2 R109#2.1 R111#2.2 R114#2.1 R122#2.2 RP1#2.1(CCW) RP3#2.1(CCW) RP4#2.1(CCW) RP6#2.1(CCW) RP8#2.1(CCW) RP9#2.1(CCW) RP10#2.1(CCW) RP12#2.1(CCW) RP13#2.1(CCW) TP1#2.1(G9) TP23#2.1(G9) TP39#2.1(G9) Z1#2.1(K)
+12: C6#2.1(+) C7#2.1 L2#2.2 R38#2.2 RG1#2.1(Input) TP9#2.1(G9) TP10#2.1(G9) TP30#2.1(G9) TP46#2.1(G9) U1#2.8(C1) U1#2.11(C2) U1#2.12(VCC) U4#2.8(C1) U4#2.11(C2) U4#2.12(VCC) U11#2.8(C1) U11#2.11(C2) U11#2.12(VCC)
GND: *1#2.11(GND) *2#2.11(GND) *3.11(GND) C2#2.1 C3#2.1 C4#2.1 C5#2.2 C6#2.2(-) C7#2.2 C8#2.1 C9#2.2 C10#2.1 C11#2.2(-) C12#2.2(-) C13#2.2(-) C14#2.1 C15#2.1 C16#2.1 C17#2.1 C18#2.1 C19#2.2(-) C21#2.1 C22#2.1 C23#2.1 C24#2.1 C25#2.2 C26#2.1 C27#2.2(-) C28#2.1 C29#2.1 C30#2.1 C31#2.1 C32#2.1 C34#2.2 C35#2.1 C36#2.2 C37#2.1 C38#2.2(-) C39#2.1 C40.1 CR2#2.2 D3#2.2(K) D7#2.2(K) D9#2.2(K) D11#2.2(K) D13#2.2(K) D15#2.2(K) HS1#2.2(GND) HS2#2.2(GND) HS3#2.2(GND) HS4#2.2(GND) HS5#2.2(GND) HS6#2.2(GND) J1#2.2 J3#2.1 J6#2.1 J9#2.1 P1#2.1 P2#2.7 P2#2.8 P3#2.1 P4#2.1 P5#2.7 P5#2.8 P6#2.1 P7#2.1 P8#2.1 P9#2.1 P10#2.1 P11#2.1 P12#2.1 P13#2.1 P14#2.1 Q3#2.2(E) Q6#2.2(E) Q9.2(E) R4#2.2 R9#2.2 R10#2.1 R14#2.2 R15#2.2 R16#2.2 R17#2.2 R19#2.2 R25#2.1 R28#2.1 R29#2.2 R31#2.2 R33#2.1 R34#2.1 R36#2.1 R40.2 R41#2.2 R42#2.2 R43#2.2 R47#2.2 R49#2.1 R50#2.2 R51#2.1 R55#2.2 R60#2.2 R69#2.1 R72#2.2 R73#2.2 R74#2.2 R75#2.1 R76#2.2 R78#2.2 R80#2.1 R81#2.1 R83#2.1 R87#2.2 R91#2.2 R92#2.2 R93#2.2 R97#2.2 R99#2.2 R100#2.1 R104#2.2 R106#2.2 R112#2.1 R115#2.1 R116#2.2 R118#2.2 R120#2.1 R121#2.1 R123#2.1 R124#2.2 RG1#2.2(GND) RP1#2.3(CW) RP2#2.2(WIPER) RP2#2.3(CW) RP3#2.3(CW) RP4#2.3(CW) RP6#2.3(CW) RP7#2.2(WIPER) RP7#2.3(CW) RP8#2.3(CW) RP9#2.3(CW) RP10#2.3(CW) RP11#2.2(WIPER) RP11#2.3(CW) RP12#2.3(CW) RP13#2.3(CW) U1#2.1(1IN+) U1#2.7(GND) U1#2.13(OUTPUT_CTRL) U1#2.16(2IN+) U2#2.2(GND) U3#2.3(GND) U3#2.5(~{ON}/OFF) U3#2.6(GND) U4#2.1(1IN+) U4#2.7(GND) U4#2.13(OUTPUT_CTRL) U4#2.16(2IN+) U5#2.3(a) U6#2.3(a) U7#2.3(a) U8#2.3(a) U9#2.3(a) U10#2.3(a) U11#2.1(1IN+) U11#2.7(GND) U11#2.13(OUTPUT_CTRL) U11#2.16(2IN+) Z1#2.2(A)
VCC: CR1#2.2 J1#2.1 Q1#2.4(DRAIN) Q4#2.4(DRAIN) Q7.4(DRAIN) R39#2.2
Net*1#1_1: *2#2.1(OUT_1) C20#2.1 R8#2.2 R44.2 R54#2.2 TP24#2.1(G9) ; port SENS_2
Net*1#1_2: *2#2.2(-INP_1) R44.1 R67#2.2 R68#2.1 R76#2.1 RP8#2.2(WIPER) TP32#2.1(G9) ; port Diff2
Net*1#1_14: *2#2.14(OUT_4) C28#2.2 D4#2.1(C) J4#2.1 R77#2.1 TP18#2.1(G9) TP37#2.1(G9) ; port FDB_2
Net*1#2_1: *1#2.1(OUT_1) C1#2.1 R1#2.2 R6#2.2 R13#2.2 TP2#2.1(G9) ; port SENS_1
Net*1#2_2: *1#2.2(-INP_1) R1#2.1 R23#2.2 R24#2.1 R29#2.1 RP3#2.2(WIPER) TP12#2.1(G9) ; port Diff1
Net*1#2_3: *1#2.3(+INP_1) R2#2.2 R3#2.1 R10#2.2 RP1#2.2(WIPER) TP5#2.1(G9)
Net*1#2_5: *1#2.5(+INP_2) R4#2.1 R5#2.2
Net*1#2_6: *1#2.6(-INP_2) C1#2.2 R13#2.1 R14#2.1 TP3#2.1(G9)
Net*1#2_7: *1#2.7(OUT_2) D1#2.2(A) R5#2.1 R12#2.2 TP4#2.1(G9)
Net*1#2_8: *1#2.8(OUT_3) D5#2.2(A) R21#2.1 R32.2 TP14#2.1(G9)
Net*1#2_9: *1#2.9(-INP_3) Q3#2.3(C) R21#2.2 R27#2.2 R33#2.2 TP15#2.1(G9)
Net*1#2_10: *1#2.10(+INP_3) R22#2.2 R34#2.2 TP13#2.1(G9)
Net*1#2_12: *1#2.12(+INP_4) R35#2.1 R40.1 RP4#2.2(WIPER) TP20#2.1(G9)
Net*1#2_13: *1#2.13(-INP_4) D1#2.1(C) D5#2.1(C) R19#2.1 R30#2.2 TP7#2.1(G9) U1#2.4(DTC)
Net*1#2_14: *1#2.14(OUT_4) C14#2.2 D2#2.1(C) J10#2.1 R30#2.1 TP19#2.1(G9) TP52.1(G9) ; port FDB_1
Net*2#1_1: *3.1(OUT_1) C33#2.1 R7#2.2 R94#2.2 R103#2.2 TP40#2.1(G9) ; port SENS_3
Net*2#1_2: *3.2(-INP_1) R94#2.1 R110#2.2 R111#2.1 R116#2.1 RP12#2.2(WIPER) TP48#2.1(G9) ; port Diff3
Net*2#1_14: *3.14(OUT_4) C39#2.2 D6#2.1(C) J7#2.1 R117#2.1 TP36#2.1(G9) TP53.1(G9) ; port FDB_3
Net*2#2_3: *2#2.3(+INP_1) R45#2.2 R46#2.1 R51#2.2 RP6#2.2(WIPER) TP27#2.1(G9)
Net*2#2_5: *2#2.5(+INP_2) R47#2.1 R48#2.2
Net*2#2_6: *2#2.6(-INP_2) C20#2.2 R54#2.1 R55#2.1 TP25#2.1(G9)
Net*2#2_7: *2#2.7(OUT_2) D8#2.2(A) R48#2.1 R53#2.2 TP26#2.1(G9)
Net*2#2_8: *2#2.8(OUT_3) D10#2.2(A) R62#2.1 R79#2.2 TP34#2.1(G9)
Net*2#2_9: *2#2.9(-INP_3) Q6#2.3(C) R62#2.2 R71#2.2 R80#2.2 TP35#2.1(G9)
Net*2#2_10: *2#2.10(+INP_3) R63#2.2 R81#2.2 TP33#2.1(G9)
Net*2#2_12: *2#2.12(+INP_4) R82#2.1 R87#2.1 RP9#2.2(WIPER) TP38#2.1(G9)
Net*2#2_13: *2#2.13(-INP_4) D8#2.1(C) D10#2.1(C) R60#2.1 R77#2.2 TP29#2.1(G9) U4#2.4(DTC)
Net*3_3: *3.3(+INP_1) R95#2.2 R96#2.1 R100#2.2 RP10#2.2(WIPER) TP43#2.1(G9)
Net*3_5: *3.5(+INP_2) R97#2.1 R98#2.2
Net*3_6: *3.6(-INP_2) C33#2.2 R103#2.1 R104#2.1 TP41#2.1(G9)
Net*3_7: *3.7(OUT_2) D12#2.2(A) R98#2.1 R102#2.2 TP42#2.1(G9)
Net*3_8: *3.8(OUT_3) D14#2.2(A) R108#2.1 R119#2.2 TP50#2.1(G9)
Net*3_9: *3.9(-INP_3) Q9.3(C) R108#2.2 R114#2.2 R120#2.2 TP51#2.1(G9)
Net*3_10: *3.10(+INP_3) R109#2.2 R121#2.2 TP49#2.1(G9)
Net*3_12: *3.12(+INP_4) R122#2.1 R124#2.1 RP13#2.2(WIPER) TP54.1(G9)
Net*3_13: *3.13(-INP_4) D12#2.1(C) D14#2.1(C) R106#2.1 R117#2.2 TP45#2.1(G9) U11#2.4(DTC)
NetC2#2_2: C2#2.2 P2#2.1 R6#2.1 R15#2.1 ; port ADC_1
NetC3#2_2: C3#2.2 P2#2.2 R8#2.1 R16#2.1 ; port ADC_2
NetC4#2_2: C4#2.2 P2#2.3 R7#2.1 R17#2.1 ; port ADC_3
NetC5#1_1: C9#2.1 C25#2.1 C36#2.1 U1#2.2(1IN-) U1#2.14(REF) U1#2.15(2IN-) U4#2.14(REF) U11#2.14(REF) ; port REF_1
NetC5#2_1: C5#2.1 L1#2.1 RG1#2.3(Output) TP8#2.1(G9)
NetC8#2_2: C8#2.2 U1#2.5(CT)
NetC10#2_2: C10#2.2 C26#2.2 C37#2.2 P5#2.4 R26#2.1 R31#2.1 R70.1 R78#2.1 R113#2.1 R118#2.1 ; port CUR_1
NetC11#1_1: C12#2.1(+) L3#2.2 RP5#2.1(CCW) TP16#2.1(G9) U2#2.1(INPUT) ; port +15V
NetC11#2_1: C11#2.1(+) L2#2.1 TP17#2.1(G9) U2#2.3(OUTPUT)
NetC15#1_1: U4#2.2(1IN-) U4#2.15(2IN-) ; port REF_2
NetC16#2_2: C16#2.2 P5#2.3 R37#2.1 R41#2.1 ; port 5V_SENS
NetC17#2_2: C17#2.2 P5#2.2 R38#2.1 R42#2.1 ; port 12V_SENS
NetC18#2_2: C18#2.2 P5#2.1 R39#2.1 R43#2.1 ; port VCC_SENS
NetC19#2_1: C19#2.1(+) CR1#2.1 U3#2.1(Vin)
NetC21#1_1: U11#2.2(1IN-) U11#2.15(2IN-) ; port REF_3
NetC21#2_2: C21#2.2 U4#2.5(CT)
NetC22#2_2: C22#2.2 HS1#2.1(OUT) R56#2.1 R64#2.1 U5#2.1(k)
NetC23#2_2: C23#2.2 HS2#2.1(OUT) R57#2.1 R65#2.1 U6#2.1(k)
NetC24#2_2: C24#2.2 HS3#2.1(OUT) R58#2.1 R66.1 U7#2.1(k)
NetC30#2_2: C30#2.2 HS4#2.1(OUT) R84#2.1 R88#2.1 U8#2.1(k)
NetC31#2_2: C31#2.2 HS5#2.1(OUT) R85#2.1 R89#2.1 U9#2.1(k)
NetC32#2_2: C32#2.2 HS6#2.1(OUT) R86#2.1 R90#2.1 U10#2.1(k)
NetC34#2_1: C34#2.1 J2#2.2 J5#2.2 J8#2.2 ; port COIL
NetC35#2_2: C35#2.2 U11#2.5(CT)
NetC38#1_2: P5#2.5 ; port CUR_2
NetC39#1_2: P5#2.6 ; port CUR_3
NetCR2#2_1: CR2#2.1 L3#2.1 TP21#2.1(G9) U3#2.2(Output)
NetD2#2_2: D2#2.2(A) P2#2.4 ; port OUT1
NetD3#2_1: D3#2.1(A) R12#2.1
NetD4#2_2: D4#2.2(A) P2#2.5 ; port OUT2
NetD6#2_2: D6#2.2(A) P2#2.6 ; port OUT3
NetD7#2_1: D7#2.1(A) R32.1
NetD9#2_1: D9#2.1(A) R53#2.1
NetD11#2_1: D11#2.1(A) R79#2.1
NetD13#2_1: D13#2.1(A) R102#2.1
NetD15#2_1: D15#2.1(A) R119#2.1
NetHS1#2_3: HS1#2.3(VCC) P6#2.3
NetHS2#2_3: HS2#2.3(VCC) P7#2.3
NetHS3#2_3: HS3#2.3(VCC) P8#2.3
NetHS4#2_3: HS4#2.3(VCC) P10#2.3
NetHS5#2_3: HS5#2.3(VCC) P11#2.3
NetHS6#2_3: HS6#2.3(VCC) P12#2.3
NetJ2#2_1: J2#2.1 Q1#2.3(SOURCE) Q2#2.3(SOURCE)
NetJ3#2_2: J3#2.2 R20#2.2 RP2#2.1(CCW)
NetJ4#2_2: J4#2.2 Q3#2.1(B) R36#2.2
NetJ5#2_1: J5#2.1 Q4#2.3(SOURCE) Q5#2.3(SOURCE)
NetJ6#2_2: J6#2.2 R61#2.2 RP7#2.1(CCW)
NetJ7#2_2: J7#2.2 Q6#2.1(B) R83#2.2
NetJ8#2_1: J8#2.1 Q7.3(SOURCE) Q8.3(SOURCE)
NetJ9#2_2: J9#2.2 R107#2.2 RP11#2.1(CCW)
NetJ10#2_2: J10#2.2 Q9.1(B) R123#2.2
NetP1#2_2: P1#2.2 R2#2.1
NetP3#2_2: P3#2.2 R23#2.1
NetP4#2_2: P4#2.2 R45#2.1
NetP6#2_2: P6#2.2 R56#2.2
NetP7#2_2: P7#2.2 R57#2.2
NetP8#2_2: P8#2.2 R58#2.2
NetP9#2_2: P9#2.2 R67#2.1
NetP10#2_2: P10#2.2 R84#2.2
NetP11#2_2: P11#2.2 R85#2.2
NetP12#2_2: P12#2.2 R86#2.2
NetP13#2_2: P13#2.2 R95#2.1
NetP14#2_2: P14#2.2 R110#2.1
NetQ1#2_1: Q1#2.1(GATE) R11#2.1 TP6#2.1(G9)
NetQ2#2_1: Q2#2.1(GATE) R18#2.1 TP11#2.1(G9)
NetQ2#2_4: Q2#2.4(DRAIN) R26#2.2 R28#2.2
NetQ4#2_1: Q4#2.1(GATE) R52#2.1 TP28#2.1(G9)
NetQ5#2_1: Q5#2.1(GATE) R59.1 TP31#2.1(G9)
NetQ5#2_4: Q5#2.4(DRAIN) R70.2 R75#2.2
NetQ7_1: Q7.1(GATE) R101#2.1 TP44#2.1(G9)
NetQ8_1: Q8.1(GATE) R105#2.1 TP47#2.1(G9)
NetQ8_4: Q8.4(DRAIN) R113#2.2 R115#2.2
NetR9#2_1: R9#2.1 R11#2.2 U1#2.9(E1)
NetR18#2_2: R18#2.2 R25#2.2 U1#2.10(E2)
NetR20#2_1: R20#2.1 U1#2.6(RT)
NetR49#2_2: R49#2.2 RP5#2.3(CW)
NetR50#2_1: R50#2.1 R52#2.2 U4#2.9(E1)
NetR59_2: R59.2 R69#2.2 U4#2.10(E2)
NetR61#2_1: R61#2.1 U4#2.6(RT)
NetR64#2_2: R64#2.2 R72#2.1 U5#2.2(REF)
NetR65#2_2: R65#2.2 R73#2.1 U6#2.2(REF)
NetR66_2: R66.2 R74#2.1 U7#2.2(REF)
NetR88#2_2: R88#2.2 R91#2.1 U8#2.2(REF)
NetR89#2_2: R89#2.2 R92#2.1 U9#2.2(REF)
NetR90#2_2: R90#2.2 R93#2.1 U10#2.2(REF)
NetR99#2_1: R99#2.1 R101#2.2 U11#2.9(E1)
NetR105#2_2: R105#2.2 R112#2.2 U11#2.10(E2)
NetR107#2_1: R107#2.1 U11#2.6(RT)
NetRP5#2_2: RP5#2.2(WIPER) TP22#2.1(G9) U3#2.4(Feedback)

Not connected (* = marked no-connect by the designer): U1#2 3(FEEDBACK)*; U4#2 3(FEEDBACK)*; U11#2 3(FEEDBACK)*

### Notes on the sheet
- (in symbol Hall_Sensor) U_Hall
- (in symbol LM324AD_SOIC14, part A) +; -
- (in symbol LM324AD_SOIC14, part B) +; -
- (in symbol LM324AD_SOIC14, part C) +; -
- (in symbol LM324AD_SOIC14, part D) -; +

### Library data of the parts
C1#2 C2#2 C3#2 C4#2 C8#2 C9#2 C10#2 C14#2 C15#2 C16#2 C17#2 C18#2 C20#2 C21#2 C25#2 C26#2 C28#2 C29#2 C33#2 C35#2 C36#2 C37#2 C39#2 C40 = C0805C104J4RACTU
C5#2 C7#2 = Cap Pol2: Polarized Capacitor (Axial); Value: 10uF; Published: 8-Jun-2000; LatestRevisionDate: 17-Jul-2002; LatestRevisionNote: Re-released for DXP Platform.; PackageReference: POLAR0.8; Publisher: Altium Limited; PackageDescription: Polarized Capacitor; 2 Leads
C6#2 C11#2 C12#2 C13#2 C19#2 C27#2 C38#2 = EEE1HA101AP: Capacitor Polarised; Manufacturer_Name: Panasonic; Datasheet Link: http://industrial.panasonic.com/cdbs/www-data/pdf/RDE0000/ABA0000C1142.pdf; Manufacturer_Part_Number: EEE1HA101AP
C22#2 C23#2 C24#2 C30#2 C31#2 C32#2 = C0805C104J4RACTU: 100pF
C34#2 = ECA-1JHG222: No Description Available; Mfr_Name: Panasonic; Type: DEV; Copyright: Copyright (C) 2022 Ultra Librarian. All rights reserved.; Manufacturer_Part_Number: ECA-1JHG222; RefDes: RefDes
CR1#2 CR2#2 = 1N5822RL: No Description Available; Mfr_Name: STMicroelectronics; Type: DEV; Copyright: Copyright (C) 2022 Ultra Librarian. All rights reserved.; Manufacturer_Part_Number: 1N5822RL; RefDes: RefDes
D3#2 D7#2 D9#2 D11#2 D13#2 D15#2 = LED2: Typical RED, GREEN, YELLOW, AMBER GaAs LED; Published: 8-Jun-2000; LatestRevisionDate: 17-Jul-2002; LatestRevisionNote: Re-released for DXP Platform.; PackageVersion: Feb-2002; PackageReference: 3.2X1.6X1.1; Publisher: Altium Limited; PackageDescription: SM LED; 2 Flat Leads
J1#2 J2#2 J5#2 J8#2 = 691101710002: WR-TBL Series 101 Horizontal Entry Modular, Through Hole, pitch 5mm, 2p; Manufacturer: Wurth Elektronik; Pin Number: 2; Rated Current: 16A; Working Voltage: 250V; PCB/Cable/Panel: PCB; Modularity: Yes; ComponentLink1Description: Manufacturer Link; ComponentLink1URL: https://www.we-online.com/redexpert/article/691101710002?ad; ComponentLink2Description: Datasheet; ComponentLink2URL: https://www.we-online.com/redexpert/spec/691101710002?ad; Category: Terminal Blocks; Match Code: WR-TBL; Manufacturer Part Number: 691101710002; Mount: Through Hole; Operating Temperature Max: 105°C; Operating Temperature Min: -40°C; Packaging: Box; Pitch: 5mm; Orientation: Horizontal; Application: Pressure Clamp
L1#2 L2#2 L3#2 = 7445720: SMD-Power Inductor WE-PD4, L = 100 µH; Inductance: 100 ÂµH; ComponentLink1Description: Manufacturer Link; ComponentLink2Description: Datasheet; DatasheetVersion: ver 1, Oct-2004; ComponentLink1URL: http://www.we-online.com; PackageVersion: 2004; PackageDescription: SMD Inductor, 2-Leads, Body 22.0 x 15.0 mm; ComponentLink2URL: http://www.we-online.de/katalog/media/pdf/7445720.pdf; PackageReference: WE-PD4-XL; PartNumber: 7445720
P1#2 P3#2 P4#2 P6#2 P7#2 P8#2 P9#2 P10#2 P11#2 P12#2 P13#2 P14#2 = 61900311121: WR-WTB THT Male Vertical Locking Header, pitch 2.54mm, 3p; Pin Number: 3; Contact Resistance: 20mOhm; Rated Current: 3A; Withstanding Voltage: 1000VAC; Working Voltage: 250VAC; ComponentLink1Description: Manufacturer; ComponentLink1URL: http://www.we-online.de; ComponentLink2Description: Datasheet; ComponentLink2URL: https://www.we-online.com/catalog/datasheet/61900311121.pdf; Pitch: 2.54mm; Published Date: January 2020; Publisher: Wurth Elektronik; Mounting Technology: THT; Packaging: Bag; Operating Temperature: -40 to +105degC; Part Number: 61900311121; Gender: Male; Type: Vertical
P2#2 P5#2 = 61900811121: WR-WTB THT Male Vertical Locking Header, pitch 2.54mm, 8p; Pin Number: 8; Contact Resistance: 20mOhm; Rated Current: 3A; Withstanding Voltage: 1000VAC; Working Voltage: 250VAC; ComponentLink1Description: Manufacturer; ComponentLink1URL: http://www.we-online.de; ComponentLink2Description: Datasheet; ComponentLink2URL: https://www.we-online.com/catalog/datasheet/61900811121.pdf; Pitch: 2.54mm; Published Date: January 2020; Publisher: Wurth Elektronik; Mounting Technology: THT; Packaging: Bag; Operating Temperature: -40 to +105degC; Part Number: 61900811121; Gender: Male; Type: Vertical
Q2#2 Q5#2 Q8 = IRFR9024N: Insulated-Gate Field-Effect Transistor (IGFET), P-Channel, Enhancement,  Body Diode, Pin 1 Gate,  3 Source, 4 Drain, 3Pins; Manufacturer: Infineon Technologies; Manufacturer Order Number: IRFR9024N; PackageReference: PG-TO252-3-901
Q3#2 Q6#2 Q9 = BC847B,215: Transistor BJT NPN; Manufacturer_Name: Nexperia; Datasheet Link: https://assets.nexperia.com/documents/data-sheet/BC847_SER.pdf; Height: 1.1mm; Manufacturer_Part_Number: BC847B,215; Mouser Part Number: 771-BC847B-T/R; Mouser Price/Stock: https://www.mouser.co.uk/ProductDetail/Nexperia/BC847B215?qs=me8TqzrmIYXXIdUoxWnHgw%3D%3D; Arrow Part Number: BC847B,215; Arrow Price/Stock: https://www.arrow.com/en/products/bc847b215/nexperia?region=nac
R1#2 R2#2 R5#2 R12#2 R13#2 R20#2 R21#2 R22#2 R23#2 R27#2 R30#2 R32 R41#2 R42#2 R43#2 R44 R45#2 R48#2 R53#2 R54#2 R61#2 R62#2 R63#2 R67#2 R77#2 R79#2 R81#2 R94#2 R95#2 R98#2 R102#2 R103#2 R107#2 R108#2 R109#2 R110#2 R117#2 R119#2 R121#2 = CRCW08050000Z0EA
  R1#2 R44 R94#2: 100k: *
  R2#2 R5#2 R12#2 R13#2 R20#2 R21#2 R22#2 R23#2 R27#2 R30#2 R32 R41#2 R42#2 R43#2 R45#2 R48#2 R53#2 R54#2 R61#2 R62#2 R63#2 R67#2 R77#2 R79#2 R81#2 R95#2 R98#2 R102#2 R103#2 R107#2 R108#2 R109#2 R110#2 R117#2 R119#2 R121#2: 10k: *
R3#2 R24#2 R46#2 R68#2 R96#2 R111#2 = CRCW08050000Z0EA: 9.1k; 10k: *
R4#2 R9#2 R11#2 R14#2 R18#2 R19#2 R25#2 R34#2 R36#2 R47#2 R49#2 R50#2 R52#2 R55#2 R56#2 R57#2 R58#2 R59 R60#2 R64#2 R65#2 R66 R69#2 R71#2 R72#2 R73#2 R74#2 R83#2 R84#2 R85#2 R86#2 R88#2 R89#2 R90#2 R91#2 R92#2 R93#2 R97#2 R99#2 R101#2 R104#2 R105#2 R106#2 R112#2 R114#2 R123#2 = CRCW08050000Z0EA: 10k; 10k: *
R6#2 R7#2 R8#2 R26#2 R35#2 R37#2 R38#2 R39#2 R70 R82#2 R113#2 R122#2 = CRCW08050000Z0EA: 7.5k; 10k: *
R10#2 R15#2 R16#2 R17#2 R29#2 R31#2 R40 R51#2 R76#2 R78#2 R87#2 R100#2 R116#2 R118#2 R124#2 = CRCW08050000Z0EA: 1k; 10k: *
R28#2 R75#2 R115#2 = TUW5JR10E: No Description Available; Mfr_Name: Ohmite; Copyright: Copyright (C) 2022 Ultra Librarian. All rights reserved.; Manufacturer_Part_Number: TUW5JR10E; RefDes: RefDes; Type: DEV
R33#2 R80#2 R120#2 = CRCW08050000Z0EA: 51k; 10k: *
RG1#2 = Reg_Fairchild_LM7805CT_eec: REG IC REG LINEAR 5V 1A TO220AB; Voltage Dropout (Max): 2V @ 1A (Typ); Voltage - Input (Max): 35V; helpURL: https://upverter.com/upn/revision/b27a7358b7dd93a3/; ComponentLink2Description: Datasheet; Temperature: -40°C to +125°C; Package: TO220; Supplier 2: Mouser; Price: 0.384521982769; Supplier 1: Digi-Key; ComponentLink1URL: https://upverter.com/upn/revision/b27a7358b7dd93a3/; Supplier Part Number 2: 512-LM7805CT; Supplier Part Number 1: LM7805CT-ND; Manufacturer: Fairchild; ComponentLink1Description: Upverter; ComponentLink2URL: https://www.fairchildsemi.com/datasheets/LM/LM7805.pdf; RoHS: TRUE; Mouser Part Number: 512-LM7805CT; Ipc Land Pattern Name: TO-220; Temperature Range High: +125°C; Digikey Description: REG IC REG LINEAR 5V 1A TO220AB; Digikey Part Number: LM7805CT-ND; Lead Free: yes; Temperature Range Low: -40°C; Voltage - Output: 5V; Current-Output: 1A
RP1#2 RP2#2 RP3#2 RP4#2 RP5#2 RP6#2 RP7#2 RP8#2 RP9#2 RP10#2 RP11#2 RP12#2 RP13#2 = 3296W-1-202LF
TP1#2 TP2#2 TP3#2 TP4#2 TP5#2 TP6#2 TP7#2 TP8#2 TP9#2 TP10#2 TP11#2 TP12#2 TP13#2 TP14#2 TP15#2 TP16#2 TP17#2 TP18#2 TP19#2 TP20#2 TP21#2 TP22#2 TP23#2 TP24#2 TP25#2 TP26#2 TP27#2 TP28#2 TP29#2 TP30#2 TP31#2 TP32#2 TP33#2 TP34#2 TP35#2 TP36#2 TP37#2 TP38#2 TP39#2 TP40#2 TP41#2 TP42#2 TP43#2 TP44#2 TP45#2 TP46#2 TP47#2 TP48#2 TP49#2 TP50#2 TP51#2 TP52-TP54 = TP_PCB?: Test_Point
U1#2 U4#2 U11#2 = TL494ID: Pulse-Width-Modulation Control Circuit with Voltage Control, 45 % Duty Cycle, -40 to +85 degC, 16-pin SOIC (D), Green (RoHS & no Sb/Br); Manufacturer: Texas Instruments; Regulated Outputs(#): 2; Topology: Boost, Buck, Flyback, Forward, Full-Bridge, Half-Bridge, Push-Pull; SubFamily: PWM Controller; Frequency(Max)(kHz): 300; Rating: Military; Duty Cycle(Max)(%): 45; ComponentLink1URL: http://www.ti.com/general/docs/lit/getliterature.tsp?genericPartNumber=TL494&fileType=pdf; DatasheetVersion: SLVS074E; Control Method: Voltage; ComponentLink1Description: Datasheet; Code_JEDEC: MS-012AC; PackageVersion: revM, Jun-2011; Eco-Plan: Green (RoHS & no Sb/Br); PartNumber: TL494ID; PackageDescription: 16-Pin Plastic Small Outline Integrated Circuit, 9.9 x 3.9 mm, Pitch 1.27 mm Pitch; Mounting Technology: Surface Mount; PackageReference: D16
U3#2 = LM2576D2T-005G
U5#2 U6#2 U7#2 U8#2 U9#2 U10#2 = IC_Nexperia_TL431AQDBZR,215_eec: IC VREF SHUNT ADJ SOT23-3; Voltage - Input: 2.495 V ~ 36 V; Tolerance: ±1%; Current - Output: 100mA; Number of Channels: 1; Current - Cathode: 600µA; Reference Type: Shunt, Adjustable, Precision; Other Names: 568-4890-6; helpURL: https://upverter.com/upn/revision/897efb4cb52176e6/; ComponentLink2Description: Datasheet; Temperature: -40°C to +125°C; Package: TO-236-3, SC-59, SOT-23-3; Supplier 2: Mouser; Price: 0.155797334872; Supplier 1: Digi-Key; ComponentLink1URL: https://upverter.com/upn/revision/897efb4cb52176e6/; Supplier Part Number 2: 771-TL431AQDBZR215; Supplier Part Number 1: 1727-4259-1-ND; Manufacturer: Nexperia; ComponentLink1Description: Upverter; ComponentLink2URL: http://assets.nexperia.com/documents/data-sheet/TL431_FAM.pdf; RoHS: TRUE; Mouser Part Number: 771-TL431AQDBZR215; Operating Temperature: -40°C ~ 125°C; Temperature Range High: +125°C; Packaging: Digi-Reel®; Digikey Description: IC VREF SHUNT ADJ SOT23-3; Digikey Part Number: 1727-4259-1-ND; Standard Package: 1; Lead Free: yes; Temperature Range Low: -40°C; Mounting Type: Surface Mount; Voltage - Output: 2.495 V ~ 36 V
Z1#2 = MM3Z5V1ST1G: Zener Diode; Manufacturer_Name: onsemi; Datasheet Link: http://www.onsemi.com/pub/Collateral/MM3Z2V4ST1-D.PDF; Height: 1.1mm; Manufacturer_Part_Number: MM3Z5V1ST1G; Mouser Part Number: 863-MM3Z5V1ST1G; Mouser Price/Stock: https://www.mouser.co.uk/ProductDetail/onsemi/MM3Z5V1ST1G?qs=HVbQlW5zcXXFXX%2FQxsNWFg%3D%3D; Arrow Part Number: MM3Z5V1ST1G; Arrow Price/Stock: https://www.arrow.com/en/products/mm3z5v1st1g/on-semiconductor?region=nac

## Nets that join several sheets
+5: levit_0.1  (48 pins), Dual_chanel (45 pins)
+12: levit_0.1  (18 pins), Dual_chanel (18 pins)
GND: levit_0.1  (166 pins), Dual_chanel (167 pins)
VCC: levit_0.1  (9 pins), Dual_chanel (6 pins)
Net*1#1_1: levit_0.1  (6 pins), Dual_chanel (6 pins)
Net*1#1_2: levit_0.1  (7 pins), Dual_chanel (7 pins)
Net*1#1_14: levit_0.1  (7 pins), Dual_chanel (7 pins)
Net*1#2_1: levit_0.1  (6 pins), Dual_chanel (6 pins)
Net*1#2_2: levit_0.1  (7 pins), Dual_chanel (7 pins)
Net*1#2_14: levit_0.1  (7 pins), Dual_chanel (7 pins)
Net*2#1_1: levit_0.1  (6 pins), Dual_chanel (6 pins)
Net*2#1_2: levit_0.1  (7 pins), Dual_chanel (7 pins)
Net*2#1_14: levit_0.1  (7 pins), Dual_chanel (7 pins)
NetC2#2_2: levit_0.1  (C25#1.2 P7#1.1 R80#1.1 R83#1.1), Dual_chanel (C2#2.2 P2#2.1 R6#2.1 R15#2.1)
NetC3#2_2: levit_0.1  (C26#1.2 P7#1.2 R82#1.1 R84#1.1), Dual_chanel (C3#2.2 P2#2.2 R8#2.1 R16#2.1)
NetC4#2_2: levit_0.1  (C27#1.2 P7#1.3 R81#1.1 R85#1.1), Dual_chanel (C4#2.2 P2#2.3 R7#2.1 R17#2.1)
NetC5#1_1: levit_0.1  (C5#1.1 U2#1.2 U2#1.14 U2#1.15), Dual_chanel (8 pins)
NetC10#2_2: levit_0.1  (C37#1.2 P8#1.4 R86#1.1 R88#1.1), Dual_chanel (10 pins)
NetC11#1_1: levit_0.1  (5 pins), Dual_chanel (5 pins)
NetC15#1_1: levit_0.1  (C15#1.1 U1#1.2 U1#1.14 U1#1.15), Dual_chanel (U4#2.2 U4#2.15)
NetC16#2_2: levit_0.1  (C28#1.2 P8#1.3 R89#1.1 R92#1.1), Dual_chanel (C16#2.2 P5#2.3 R37#2.1 R41#2.1)
NetC17#2_2: levit_0.1  (C29#1.2 P8#1.2 R90#1.1 R93#1.1), Dual_chanel (C17#2.2 P5#2.2 R38#2.1 R42#2.1)
NetC18#2_2: levit_0.1  (C30#1.2 P8#1.1 R91#1.1 R94#1.1), Dual_chanel (C18#2.2 P5#2.1 R39#2.1 R43#2.1)
NetC21#1_1: levit_0.1  (C21#1.1 U5#1.2 U5#1.14 U5#1.15), Dual_chanel (U11#2.2 U11#2.15)
NetC38#1_2: levit_0.1  (C38#1.2 P8#1.5 R95#1.1 R97#1.1), Dual_chanel (P5#2.5)
NetC39#1_2: levit_0.1  (C39#1.2 P8#1.6 R98#1.1 R100#1.1), Dual_chanel (P5#2.6)
NetD2#2_2: levit_0.1  (D19.2 P7#1.4), Dual_chanel (D2#2.2 P2#2.4)
NetD4#2_2: levit_0.1  (D20.2 P7#1.5), Dual_chanel (D4#2.2 P2#2.5)
NetD6#2_2: levit_0.1  (D21.2 P7#1.6), Dual_chanel (D6#2.2 P2#2.6)